# Altium schematic sheet PATHOS_ControllerBoardExp.SchDoc: Main Schematic
size A4; Author: A. Kalberer; CompanyName: NTB; Organization: NTB Interstate University of Applied; Address1: Werdenbergstrasse 4; Address3: 9471 Buchs; Address4: Switzerland; Revision: 0.1; SheetNumber: 1; SheetTotal: 2; Organization1: Sciences of Technology Buchs; Size: A4
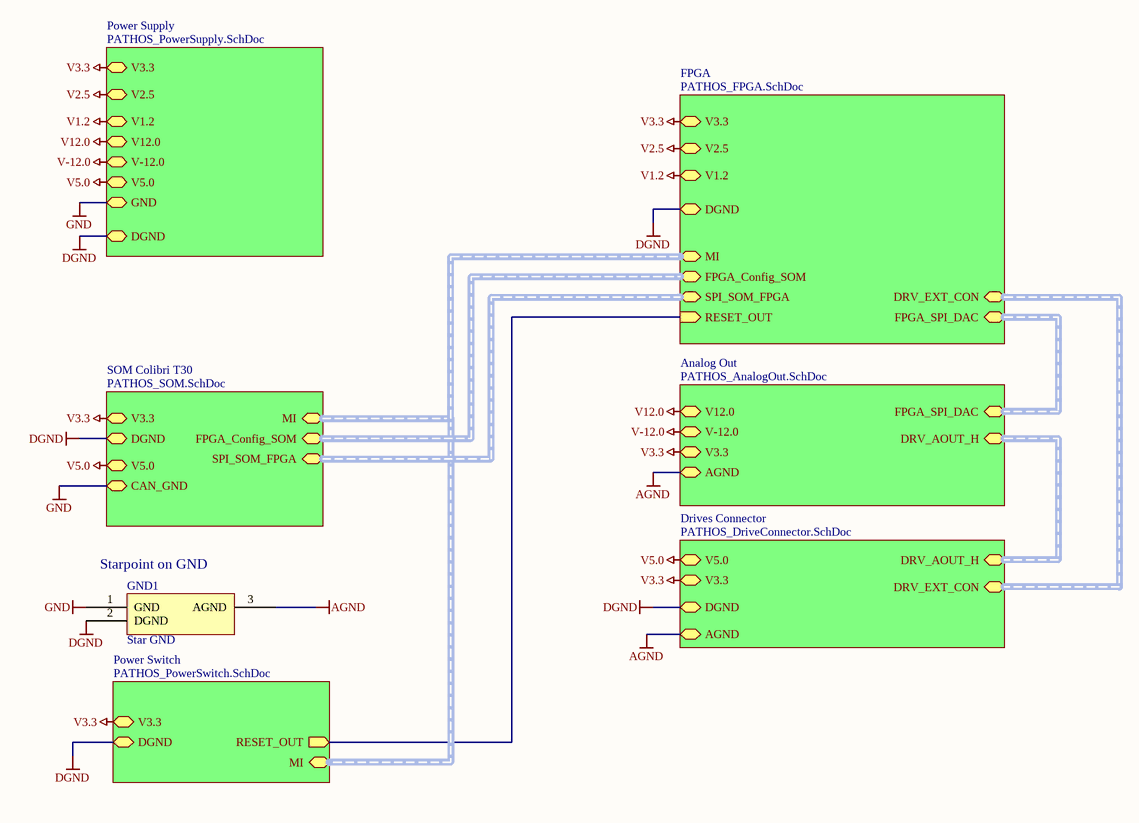
[diagram p0: PATHOS_ControllerBoardExp.SchDoc]

## Parts
GND1  Star GND  [NetTieGND]  (net tie, no BOM)

## Sub-sheets
Analog Out = PATHOS_AnalogOut.SchDoc: FPGA_SPI_DAC (harness FPGA_SPI_DAC), V12.0, V-12.0, AGND, V3.3, DRV_AOUT_H (harness DRV_AOUT_H)
Drives Connector = PATHOS_DriveConnector.SchDoc: DRV_EXT_CON (harness DRV_EXT_CON), DRV_AOUT_H (harness DRV_AOUT_H), V5.0, DGND, AGND, V3.3
FPGA = PATHOS_FPGA.SchDoc: V3.3, V2.5, V1.2, DGND (bidir), MI (harness MI), FPGA_Config_SOM (harness FPGA_Config_SOM), RESET_OUT (in), SPI_SOM_FPGA (harness SPI_SOM_FPGA), FPGA_SPI_DAC (harness FPGA_SPI_DAC), DRV_EXT_CON (harness DRV_EXT_CON)
Power Supply = PATHOS_PowerSupply.SchDoc: GND, V1.2, V2.5, V3.3, V5.0, V12.0, V-12.0, DGND
Power Switch = PATHOS_PowerSwitch.SchDoc: V3.3, DGND, MI (harness MI), RESET_OUT (out)
SOM Colibri T30 = PATHOS_SOM.SchDoc: V3.3, DGND (bidir), MI (harness MI), FPGA_Config_SOM (harness FPGA_Config_SOM), SPI_SOM_FPGA (harness SPI_SOM_FPGA), V5.0, CAN_GND

## Nets
AGND: GND1.3(AGND) ; sheet Analog Out/AGND, sheet Drives Connector/AGND
DGND: GND1.2(DGND) ; sheet Power Supply/DGND, sheet FPGA/DGND, sheet SOM Colibri T30/DGND, sheet Power Switch/DGND, sheet Drives Connector/DGND
GND: GND1.1(GND) ; sheet Power Supply/GND, sheet SOM Colibri T30/CAN_GND
V1.2: sheet Power Supply/V1.2, sheet FPGA/V1.2
V2.5: sheet Power Supply/V2.5, sheet FPGA/V2.5
V3.3: sheet Power Supply/V3.3, sheet FPGA/V3.3, sheet SOM Colibri T30/V3.3, sheet Power Switch/V3.3, sheet Analog Out/V3.3, sheet Drives Connector/V3.3
V5.0: sheet Power Supply/V5.0, sheet SOM Colibri T30/V5.0, sheet Drives Connector/V5.0
V12.0: sheet Power Supply/V12.0, sheet Analog Out/V12.0
V-12.0: sheet Power Supply/V-12.0, sheet Analog Out/V-12.0
(unnamed): sheet FPGA/RESET_OUT, sheet Power Switch/RESET_OUT

## Buses and harness runs
harness sheet Analog Out/DRV_AOUT_H = sheet Drives Connector/DRV_AOUT_H
harness sheet Analog Out/FPGA_SPI_DAC = sheet FPGA/FPGA_SPI_DAC
harness sheet Drives Connector/DRV_EXT_CON = sheet FPGA/DRV_EXT_CON
harness sheet FPGA/FPGA_Config_SOM = sheet SOM Colibri T30/FPGA_Config_SOM
harness sheet FPGA/MI = sheet Power Switch/MI = sheet SOM Colibri T30/MI
harness sheet FPGA/SPI_SOM_FPGA = sheet SOM Colibri T30/SPI_SOM_FPGA

## Notes on the sheet
- (near GND1) Starpoint on GND
- Title:
- Description:
- Size:
- Date:
- Name:
- Number:
- Time:
- Revision:
- Sheet
- Checked:
- of
- File:

## Library data of the parts
GND1 = NetTie